# EAGLE board SE423_F28379D (EAGLE 7.7.0), part 1 of 2
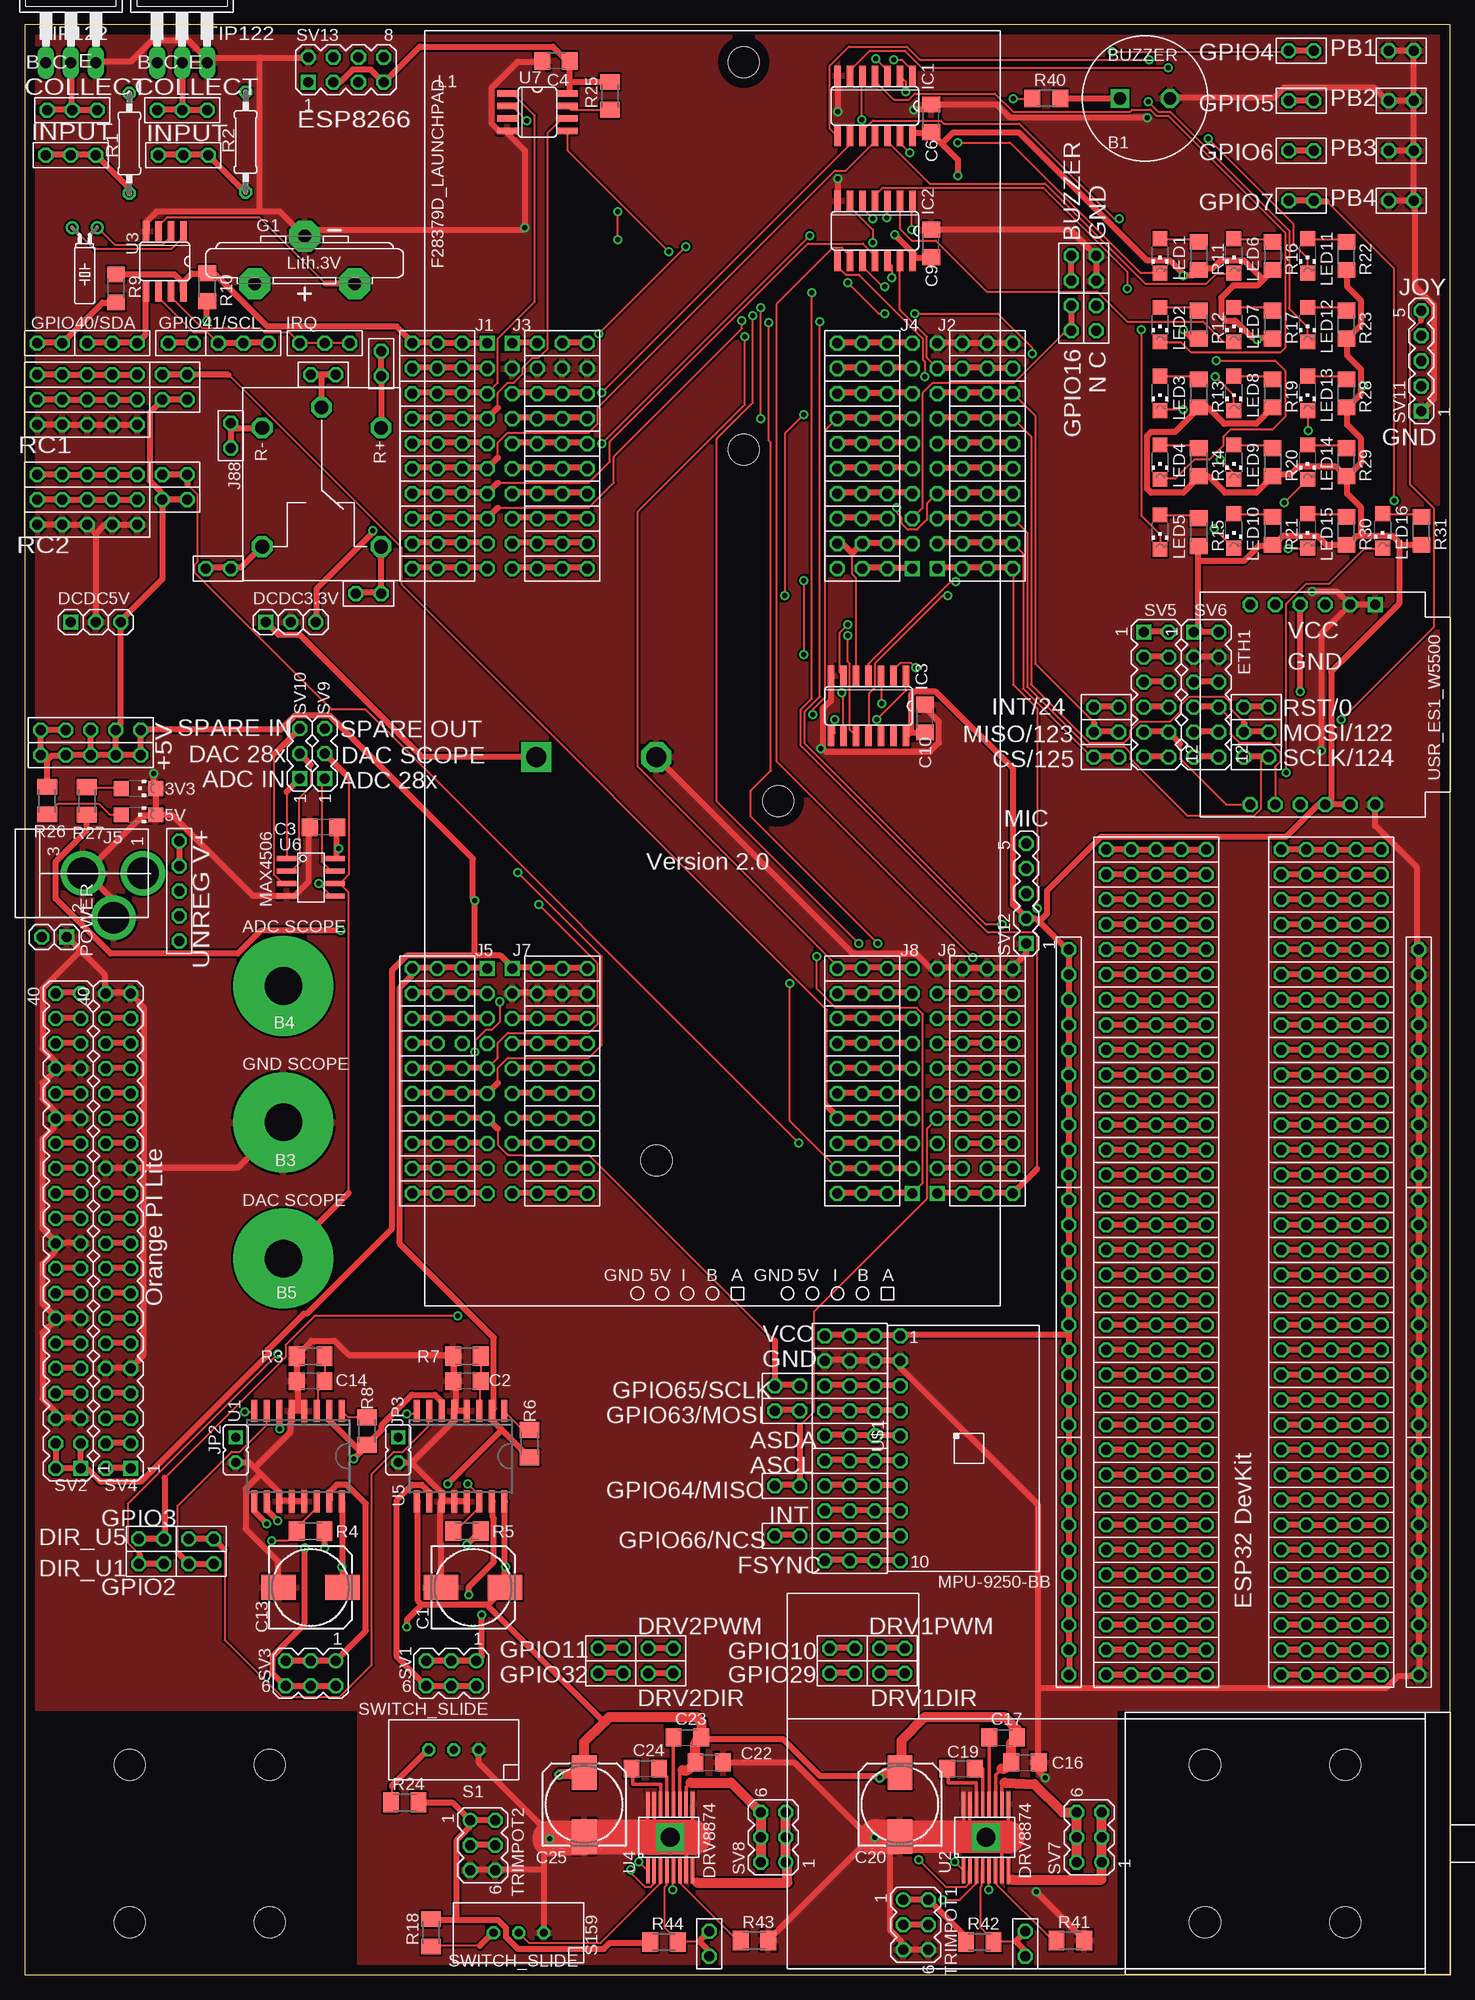
[diagram p5: board, top side]
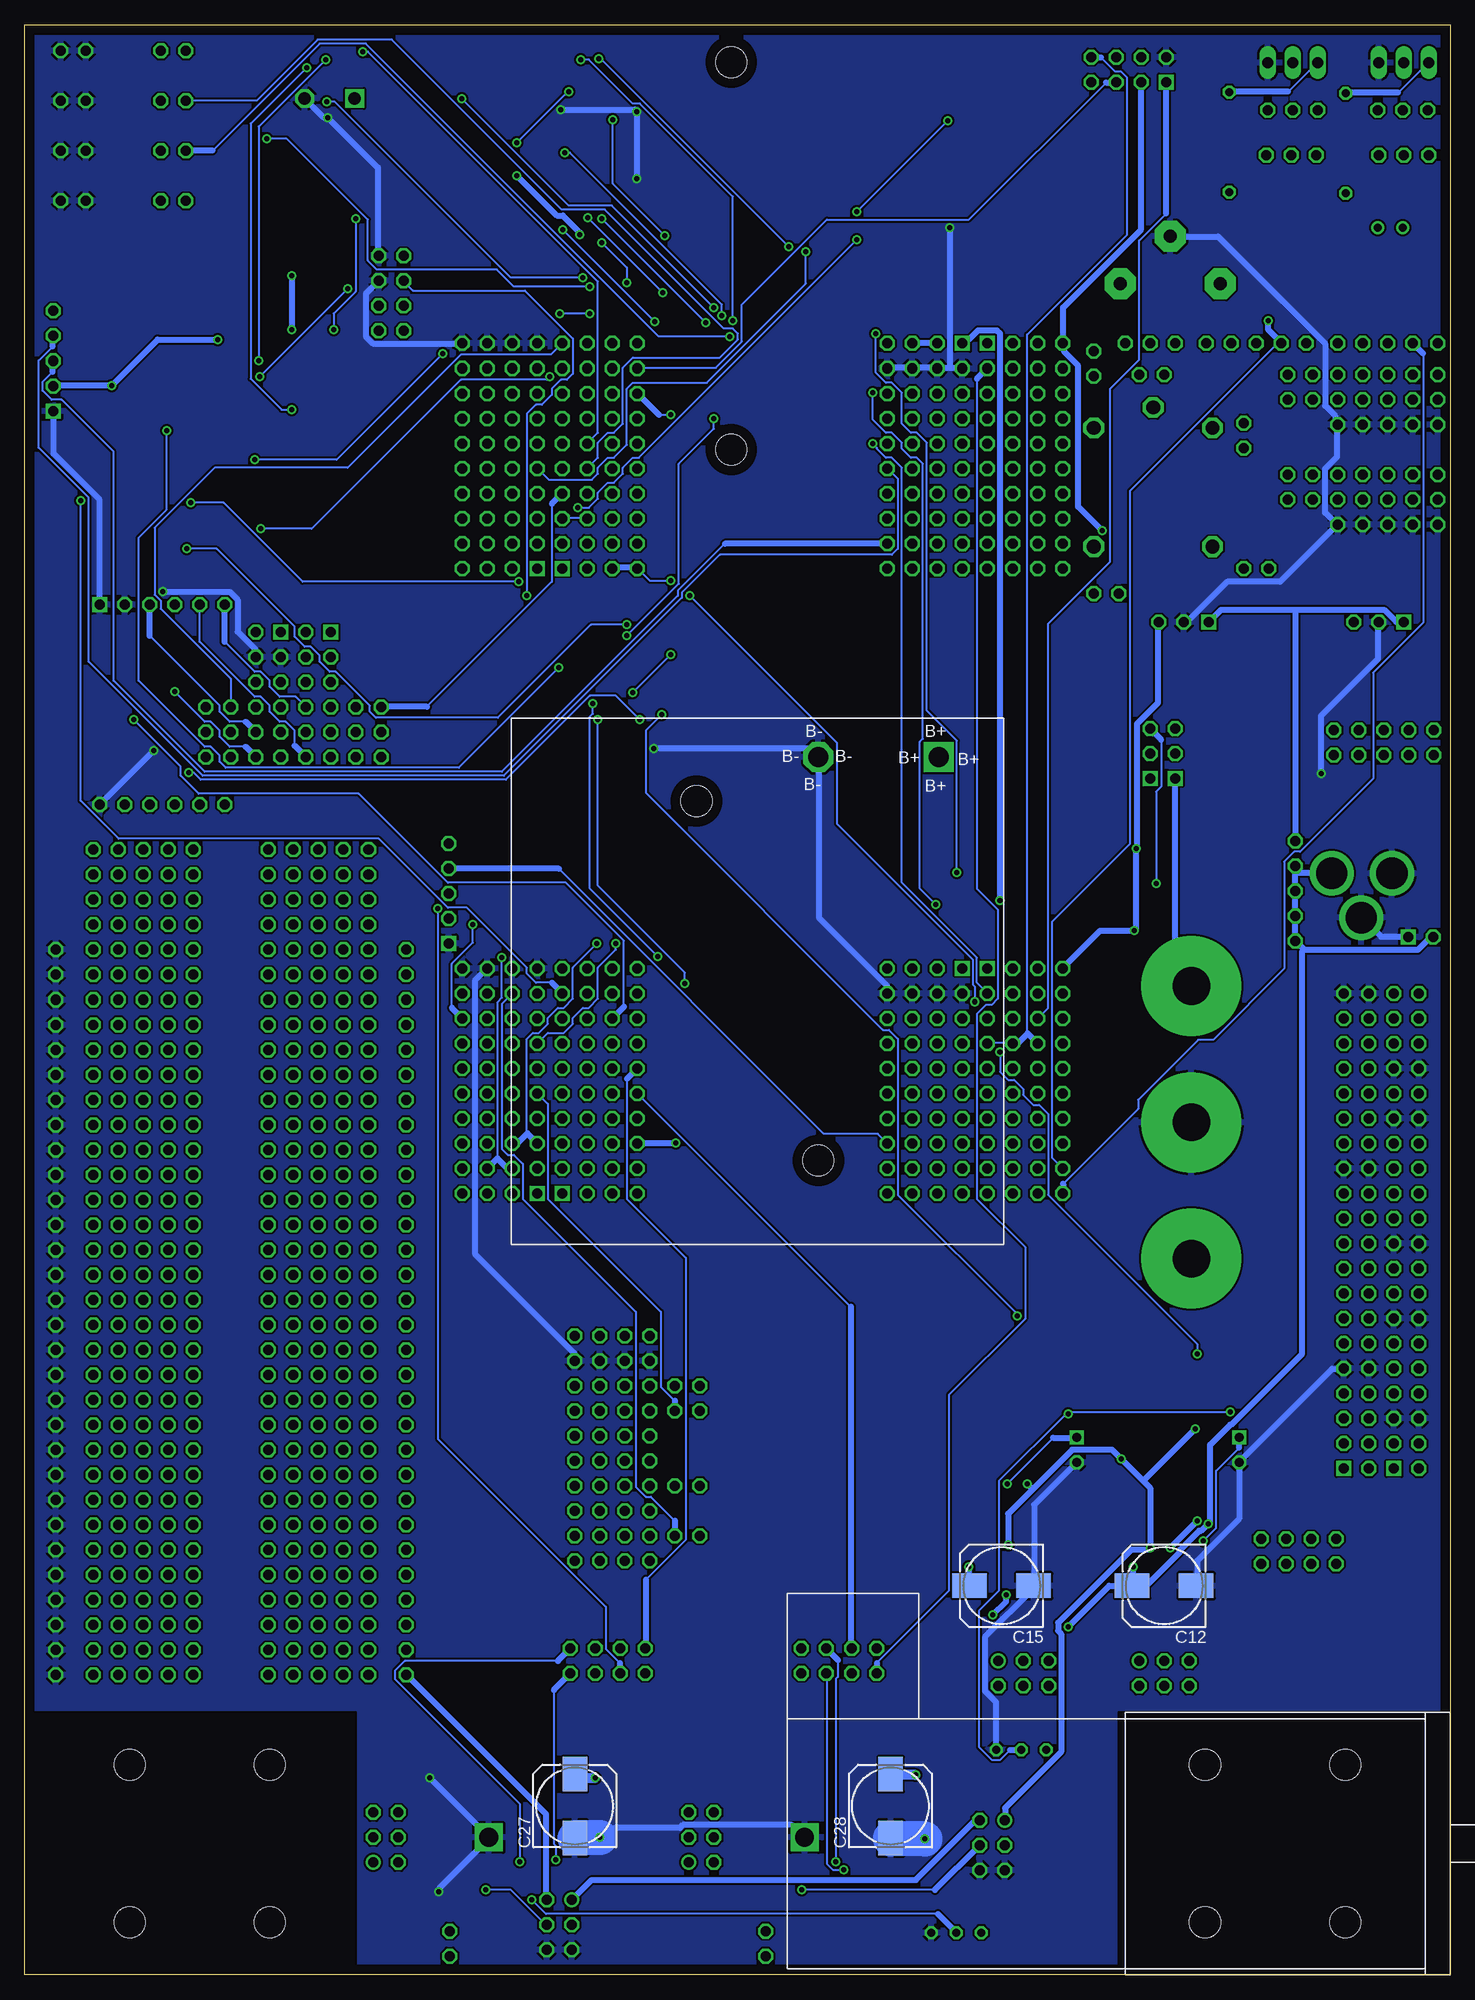
[diagram p6: board, bottom side, seen from below]

Size 144.78 x 198.12 mm. Coordinates in mm from the lower left corner, seen from the top.
Outline: 0,0 144.78,0 144.78,198.12 0,198.12 0,0
Copper layers (1*16): Top 0.035mm / dielectric 1.5mm / Bottom 0.035mm
Design rules "default *": minimum track width 7mil, minimum drill 20mil, track to track 8mil, track to pad 8mil, pad to pad 8mil, via to via 8mil, smd to smd 8mil, copper to edge 40mil, drill to drill 8mil, minimum pad ring 10mil, minimum via ring 8mil, stop-mask expansion 4mil, vias tented up to drill 20mil, thermal gap 10mil
Net classes: 0 default: width 0.203 mm, drill 0.508 mm, clearance 0.203 mm; 1 supply: width 0.61 mm, drill 0.508 mm, clearance 0.203 mm
tRestrict: area 0,0 to 33.7,26.7; area 111.1,0 to 144.8,26.7
bRestrict: area 111.1,0 to 144.8,26.7; area 0,0 to 33.7,26.7

## Footprints (pad centres in the part's own frame; a part is rotated, then mirrored left to right if it is on the bottom)
CHIPLED_1206 = smd 1.5 x 1.5: A 0,-1.75; C 0,1.75
BUZZER = drill 1.27 square: P$1 -2.54,0 | drill 1.27 octagon: P$2 2.54,0
BATTERY_4AA_HOLDER = drill 2.032 square: P$1 0,0 | drill 2.032 octagon: P$2 12.224,0 | hole 3.175: 12.224,40.958; 24.606,4.445
BANANA_MALE = drill 3.81 pad 10.16: P$1 0,0
153CLV-0810 = smd 3.5 x 2.5: + 3.25,0; - -3.25,0
C1206 = smd 1.6 x 1.8: 1 -1.4,0; 2 1.4,0
1X03 = drill 1.016 square: 1 -2.54,0 | drill 1.016 octagon: 2 0,0; 3 2.54,0
USR_ES1_W5500 = drill 1.016 square: P$1 0,0 | drill 1.016 octagon: P$2 0,-2.54; P$3 0,-5.08; P$4 0,-7.62; P$5 0,-10.16; P$6 0,-12.7; P$7 20.32,-12.7; P$8 20.32,-10.16; P$9 20.32,-7.62; P$10 20.32,-5.08; P$11 20.32,-2.54; P$12 20.32,0
CR2032V = drill 1.321 pad 3.15 octagon: + -2.54,-5.08; +@1 -2.54,5.08; - 2.286,0
SO14 = smd 0.66 x 2.032: 1 -3.81,-3.073; 2 -2.54,-3.073; 3 -1.27,-3.073; 4 0,-3.073; 5 1.27,-3.073; 6 2.54,-3.073; 7 3.81,-3.073; 8 3.81,3.073; 9 2.54,3.073; 10 1.27,3.073; 11 0,3.073; 12 -1.27,3.073; 13 -2.54,3.073; 14 -3.81,3.073
STRIP3 = drill 1.016 octagon: P$1 0,0; P$2 2.54,0; P$3 5.08,0
JACK-PMS = drill 3.175 pad 4.5: 1 -0.5,-3.31; 2 -5,-0.31; 3 -0.5,2.809
STRIP2 = drill 1.016 octagon: P$1 0,0; P$2 2.54,0
RELAY_JQC-3F_5V = drill 1.397 octagon: P$1 0,0; P$2 2.064,6.032; P$3 14.129,6.032; P$4 14.129,-6.032; P$5 2.064,-6.032
JP1 = drill 0.914 square: 1 0,-1.27 | drill 0.914 octagon: 2 0,1.27
F28379D_LAUNCHPAD = drill 1.016 square: P$1 -24.13,33.02; P$11 21.59,10.16; P$21 -21.59,33.02; P$31 19.05,10.16; P$41 -24.13,-30.48; P$51 21.59,-53.34; P$61 -21.59,-30.48; P$71 19.05,-53.34 | drill 1.016 octagon: P$2 -24.13,30.48; P$3 -24.13,27.94; P$4 -24.13,25.4; P$5 -24.13,22.86; P$6 -24.13,20.32; P$7 -24.13,17.78; P$8 -24.13,15.24; P$9 -24.13,12.7; P$10 -24.13,10.16; P$12 21.59,12.7; P$13 21.59,15.24; P$14 21.59,17.78; P$15 21.59,20.32; P$16 21.59,22.86; P$17 21.59,25.4; P$18 21.59,27.94; P$19 21.59,30.48; P$20 21.59,33.02; P$22 -21.59,30.48; P$23 -21.59,27.94; P$24 -21.59,25.4; P$25 -21.59,22.86; P$26 -21.59,20.32; P$27 -21.59,17.78; P$28 -21.59,15.24; P$29 -21.59,12.7; P$30 -21.59,10.16; P$32 19.05,12.7; P$33 19.05,15.24; P$34 19.05,17.78; P$35 19.05,20.32; P$36 19.05,22.86; P$37 19.05,25.4; P$38 19.05,27.94; P$39 19.05,30.48; P$40 19.05,33.02; P$42 -24.13,-33.02; P$43 -24.13,-35.56; P$44 -24.13,-38.1; P$45 -24.13,-40.64; P$46 -24.13,-43.18; P$47 -24.13,-45.72; P$48 -24.13,-48.26; P$49 -24.13,-50.8; P$50 -24.13,-53.34; P$52 21.59,-50.8; P$53 21.59,-48.26; P$54 21.59,-45.72; P$55 21.59,-43.18; P$56 21.59,-40.64; P$57 21.59,-38.1; P$58 21.59,-35.56; P$59 21.59,-33.02; P$60 21.59,-30.48; P$62 -21.59,-33.02; P$63 -21.59,-35.56; P$64 -21.59,-38.1; P$65 -21.59,-40.64; P$66 -21.59,-43.18; P$67 -21.59,-45.72; P$68 -21.59,-48.26; P$69 -21.59,-50.8; P$70 -21.59,-53.34; P$72 19.05,-50.8; P$73 19.05,-48.26; P$74 19.05,-45.72; P$75 19.05,-43.18; P$76 19.05,-40.64; P$77 19.05,-38.1; P$78 19.05,-35.56; P$79 19.05,-33.02; P$80 19.05,-30.48
1X02 = drill 1.016 square: 1 -1.27,0 | drill 1.016 octagon: 2 1.27,0
TC26H = drill 0.813: 1 -1.27,0; 2 1.27,0
0207/10 = drill 0.813 octagon: 1 -5.08,0; 2 5.08,0
M1206 = smd 1.6 x 2: 1 -1.4,0; 2 1.4,0
R1206 = smd 1.6 x 1.803: 1 -1.422,0; 2 1.422,0
SWITCH_SLIDE = drill 0.813 octagon: P$1 0,-5.08; P$2 0,-2.54; P$3 0,0
STRIP5 = drill 1.016 octagon: P$1 0,0; P$2 2.54,0; P$3 5.08,0; P$4 7.62,0; P$5 10.16,0
STRIP10 = drill 1.016 octagon: P$1 0,0; P$2 2.54,0; P$3 5.08,0; P$4 7.62,0; P$5 10.16,0; P$6 12.7,0; P$7 15.24,0; P$8 17.78,0; P$9 20.32,0; P$10 22.86,0
MA03-2 = drill 1.016: 1 -2.54,-1.27 | drill 1.016 octagon: 2 -2.54,1.27; 3 0,-1.27; 4 0,1.27; 5 2.54,-1.27; 6 2.54,1.27
MA20-2 = drill 1.016 square: 1 -24.13,-1.27 | drill 1.016 octagon: 2 -24.13,1.27; 3 -21.59,-1.27; 4 -21.59,1.27; 5 -19.05,-1.27; 6 -19.05,1.27; 7 -16.51,-1.27; 8 -16.51,1.27; 9 -13.97,-1.27; 10 -13.97,1.27; 11 -11.43,-1.27; 12 -11.43,1.27; 13 -8.89,-1.27; 14 -8.89,1.27; 15 -6.35,-1.27; 16 -6.35,1.27; 17 -3.81,-1.27; 18 -3.81,1.27; 19 -1.27,-1.27; 20 -1.27,1.27; 21 1.27,-1.27; 22 1.27,1.27; 23 3.81,-1.27; 24 3.81,1.27; 25 6.35,-1.27; 26 6.35,1.27; 27 8.89,-1.27; 28 8.89,1.27; 29 11.43,-1.27; 30 11.43,1.27; 31 13.97,-1.27; 32 13.97,1.27; 33 16.51,-1.27; 34 16.51,1.27; 35 19.05,-1.27; 36 19.05,1.27; 37 21.59,-1.27; 38 21.59,1.27; 39 24.13,-1.27; 40 24.13,1.27
MA06-2 = drill 1.016 square: 1 -6.35,-1.27 | drill 1.016 octagon: 2 -6.35,1.27; 3 -3.81,-1.27; 4 -3.81,1.27; 5 -1.27,-1.27; 6 -1.27,1.27; 7 1.27,-1.27; 8 1.27,1.27; 9 3.81,-1.27; 10 3.81,1.27; 11 6.35,-1.27; 12 6.35,1.27
MA03-1 = drill 1.016 square: 1 -2.54,0 | drill 1.016 octagon: 2 0,0; 3 2.54,0
MA05-1 = drill 1.016 square: 1 -5.08,0 | drill 1.016 octagon: 2 -2.54,0; 3 0,0; 4 2.54,0; 5 5.08,0
MA04-2 = drill 1.016 square: 1 -3.81,-1.27 | drill 1.016 octagon: 2 -3.81,1.27; 3 -1.27,-1.27; 4 -1.27,1.27; 5 1.27,-1.27; 6 1.27,1.27; 7 3.81,-1.27; 8 3.81,1.27
TO220 = drill 1.118 long: 1 -2.54,-6.35; 2 0,-6.35; 3 2.54,-6.35
SO16W = smd 0.6 x 2.2: 1 -4.445,-4.6; 2 -3.175,-4.6; 3 -1.905,-4.6; 4 -0.635,-4.6; 5 0.635,-4.6; 6 1.905,-4.6; 7 3.175,-4.6; 8 4.445,-4.6; 9 4.445,4.6; 10 3.175,4.6; 11 1.905,4.6; 12 0.635,4.6; 13 -0.635,4.6; 14 -1.905,4.6; 15 -3.175,4.6; 16 -4.445,4.6
HTSSOP16 = smd 2.5 x 0.35: P$1 -3.4,2.275; P$2 -3.4,1.625; P$3 -3.4,0.975; P$4 -3.4,0.325; P$5 -3.4,-0.325; P$6 -3.4,-0.975; P$7 -3.4,-1.625; P$8 -3.4,-2.275; P$9 3.4,-2.275; P$10 3.4,-1.625; P$11 3.4,-0.975; P$12 3.4,-0.325; P$13 3.4,0.325; P$14 3.4,0.975; P$15 3.4,1.625; P$16 3.4,2.275 | drill 1.905 pad 2.54 square: P$17 0,0
SO08 = smd 0.66 x 2.032: 1 -1.905,-3.073; 2 -0.635,-3.073; 3 0.635,-3.073; 4 1.905,-3.073; 5 1.905,3.073; 6 0.635,3.073; 7 -0.635,3.073; 8 -1.905,3.073
SOIC-8 = smd 1.98 x 0.53: P$1 -2.465,1.905; P$2 -2.465,0.635; P$3 -2.465,-0.635; P$4 -2.465,-1.905; P$5 2.465,-1.905; P$6 2.465,-0.635; P$7 2.465,0.635; P$8 2.465,1.905
MPU-9250-BB = drill 1.016 octagon: 1 -11.434,-6.96; 2 -8.894,-6.96; 3 -6.354,-6.96; 4 -3.814,-6.96; 5 -1.274,-6.96; 6 1.266,-6.96; 7 3.806,-6.96; 8 6.346,-6.96; 9 8.886,-6.96; 10 11.426,-6.96
GEARMOTOR_MOUNT = hole 3.175: 7.112,8.001; -7.112,8.001; -7.112,-8.001; 7.112,-8.001
CASTERWHEEL = hole 3.175: 19.685,0; -19.685,0

## Placement (x,y rotation side)
3V3  [CHIPLED_1206]  11.56,120.52 270 top
5V  [CHIPLED_1206]  11.56,117.86 270 top
B1  BUZZER  [BUZZER]  113.79,190.63 0 top
B2  BATTERY_4AA_HOLDER  [BATTERY_4AA_HOLDER]  51.94,123.7 180 bottom
B3  GND SCOPE  [BANANA_MALE]  26.29,86.61 0 top
B4  ADC SCOPE  [BANANA_MALE]  26.29,100.46 0 top
B5  DAC SCOPE  [BANANA_MALE]  26.29,72.77 0 top
C1  47uF  [153CLV-0810]  45.56,39.36 0 top
C2  680pF  [C1206]  44.92,60.32 180 top
C3  0.1uf  [C1206]  30.35,116.59 180 top
C4  0.1uf  [C1206]  53.98,194.44 180 top
C6  0.1uf  [C1206]  92.08,188.59 90 top
C9  0.1uf  [C1206]  92.08,175.9 90 top
C10  0.1uf  [C1206]  91.44,127.64 90 top
C12  47uF  [153CLV-0810]  29.05,39.53 180 bottom
C13  47uF  [153CLV-0810]  29.05,39.36 0 top
C14  680pF  [C1206]  29.05,60.32 180 top
C15  47uF  [153CLV-0810]  45.56,39.53 180 bottom
C16  0.1uF  [C1206]  101.6,21.59 0 top
C17  0.1uF  [C1206]  99.38,24.13 0 top
C19  22nF  [C1206]  95.09,20.95 0 top
C20  47uF  [153CLV-0810]  88.9,17.3 90 top
C22  0.1uF  [C1206]  69.53,21.59 0 top
C23  0.1uF  [C1206]  67.31,24.13 0 top
C24  22nF  [C1206]  63.02,20.95 0 top
C25  47uF  [153CLV-0810]  56.83,17.3 90 top
C27  47uF  [153CLV-0810]  88.9,17.14 90 bottom
C28  47uF  [153CLV-0810]  56.83,17.14 90 bottom
DCDC3.3V  [1X03]  27.05,137.41 0 top
DCDC5V  [1X03]  7.24,137.41 0 top
ETH1  USR_ES1_W5500  [USR_ES1_W5500]  137.16,139.19 270 top
G1  CR2032V  [CR2032V]  28.44,174.33 90 top
IC1  7404D  [SO14]  86.36,189.87 180 top
IC2  7404D  [SO14]  86.36,177.16 180 top
IC3  7404D  [SO14]  85.72,128.91 180 top
J1  STRIP3  [STRIP3]  27.94,165.74 0 top
J2  STRIP3  [STRIP3]  19.68,165.74 0 top
J3  STRIP3  [STRIP3]  6.35,165.74 0 top
J4  STRIP3  [STRIP3]  2.28,189.45 0 top
J5  [JACK-PMS]  8.72,112.4 90 top
J6  STRIP3  [STRIP3]  2.15,184.87 0 top
J7  STRIP2  [STRIP2]  108.84,172.09 90 top
J8  STRIP2  [STRIP2]  108.84,167 90 top
J9  STRIP2  [STRIP2]  108.58,128.78 0 top
J10  STRIP3  [STRIP3]  39.37,165.74 0 top
J11  STRIP2  [STRIP2]  123.83,128.78 0 top
J14  STRIP3  [STRIP3]  39.37,163.19 0 top
J15  STRIP3  [STRIP3]  39.37,160.66 0 top
J16  STRIP3  [STRIP3]  39.37,158.12 0 top
J17  STRIP3  [STRIP3]  39.37,155.57 0 top
J18  STRIP3  [STRIP3]  39.37,153.03 0 top
J19  STRIP3  [STRIP3]  39.37,150.5 0 top
J20  STRIP3  [STRIP3]  39.37,147.96 0 top
J21  STRIP3  [STRIP3]  39.37,145.41 0 top
J23  STRIP3  [STRIP3]  13.46,189.45 0 top
J24  STRIP3  [STRIP3]  13.58,184.87 0 top
J28  STRIP3  [STRIP3]  39.37,142.88 0 top
J29  STRIP3  [STRIP3]  95.25,142.88 0 top
J30  STRIP3  [STRIP3]  95.25,145.41 0 top
J31  STRIP3  [STRIP3]  95.25,147.96 0 top
J32  STRIP3  [STRIP3]  95.25,150.5 0 top
J33  STRIP3  [STRIP3]  95.25,153.03 0 top
J66  STRIP2  [STRIP2]  123.83,126.24 0 top
J67  STRIP2  [STRIP2]  108.58,126.24 0 top
J68  STRIP2  [STRIP2]  123.83,123.7 0 top
J69  STRIP2  [STRIP2]  108.58,123.7 0 top
J70  STRIP2  [STRIP2]  141.1,195.45 180 top
J71  STRIP2  [STRIP2]  130.94,195.45 180 top
J72  STRIP2  [STRIP2]  141.1,190.37 180 top
J73  STRIP2  [STRIP2]  130.94,190.37 180 top
J74  STRIP2  [STRIP2]  141.1,185.29 180 top
J75  STRIP2  [STRIP2]  130.94,185.29 180 top
J76  STRIP2  [STRIP2]  141.1,180.21 180 top
J77  STRIP2  [STRIP2]  130.94,180.21 180 top
J78  STRIP2  [STRIP2]  101.6,4.45 270 top
J79  STRIP2  [STRIP2]  86.84,33.18 0 top
J80  STRIP2  [STRIP2]  86.84,30.64 0 top
J81  STRIP2  [STRIP2]  69.53,4.45 270 top
J82  STRIP2  [STRIP2]  63.34,33.18 0 top
J83  STRIP2  [STRIP2]  63.34,30.64 0 top
J84  STRIP2  [STRIP2]  81.76,33.18 0 top
J85  STRIP2  [STRIP2]  81.76,30.64 0 top
J86  STRIP2  [STRIP2]  58.26,33.18 0 top
J87  STRIP2  [STRIP2]  58.26,30.64 0 top
J88  RELAY_JQC-3F_5V  [RELAY_JQC-3F_5V]  30.16,159.23 270 top
J89  STRIP2  [STRIP2]  36.2,164.94 270 top
J90  STRIP2  [STRIP2]  20.95,157.64 270 top
J91  STRIP2  [STRIP2]  29.05,162.56 0 top
J92  STRIP2  [STRIP2]  33.66,140.34 0 top
J93  STRIP2  [STRIP2]  18.41,142.88 0 top
J98  STRIP3  [STRIP3]  95.25,155.57 0 top
J99  STRIP3  [STRIP3]  95.25,158.12 0 top
J100  STRIP3  [STRIP3]  95.25,160.66 0 top
J101  STRIP3  [STRIP3]  95.25,163.19 0 top
J102  STRIP3  [STRIP3]  95.25,165.74 0 top
J103  STRIP3  [STRIP3]  52.07,165.74 0 top
J104  STRIP3  [STRIP3]  52.07,163.19 0 top
J105  STRIP3  [STRIP3]  52.07,160.66 0 top
J106  STRIP3  [STRIP3]  52.07,158.12 0 top
J107  STRIP3  [STRIP3]  52.07,155.57 0 top
J108  STRIP3  [STRIP3]  52.07,153.03 0 top
J109  STRIP3  [STRIP3]  52.07,150.5 0 top
J110  STRIP3  [STRIP3]  52.07,147.96 0 top
J111  STRIP3  [STRIP3]  52.07,145.41 0 top
J112  STRIP3  [STRIP3]  52.07,142.88 0 top
J113  STRIP3  [STRIP3]  82.55,142.88 0 top
J114  STRIP3  [STRIP3]  82.55,145.41 0 top
J115  STRIP3  [STRIP3]  82.55,147.96 0 top
J116  STRIP3  [STRIP3]  82.55,150.5 0 top
J117  STRIP3  [STRIP3]  82.55,153.03 0 top
J118  STRIP3  [STRIP3]  82.55,155.57 0 top
J119  STRIP3  [STRIP3]  82.55,158.12 0 top
J120  STRIP3  [STRIP3]  82.55,160.66 0 top
J121  STRIP3  [STRIP3]  82.55,163.19 0 top
J122  STRIP3  [STRIP3]  82.55,165.74 0 top
J123  STRIP3  [STRIP3]  81.28,64.93 0 top
J124  STRIP3  [STRIP3]  81.28,62.39 0 top
J125  STRIP3  [STRIP3]  81.28,59.85 0 top
J126  STRIP3  [STRIP3]  81.28,57.31 0 top
J127  STRIP3  [STRIP3]  81.28,54.77 0 top
J128  STRIP3  [STRIP3]  81.28,52.23 0 top
J129  STRIP3  [STRIP3]  81.28,49.69 0 top
J130  STRIP3  [STRIP3]  81.28,47.15 0 top
J131  STRIP3  [STRIP3]  81.28,44.61 0 top
J132  STRIP3  [STRIP3]  81.28,42.07 0 top
J133  STRIP3  [STRIP3]  82.55,102.23 0 top
J134  STRIP3  [STRIP3]  82.55,99.69 0 top
J135  STRIP3  [STRIP3]  82.55,97.16 0 top
J136  STRIP3  [STRIP3]  82.55,94.61 0 top
J137  STRIP3  [STRIP3]  82.55,92.08 0 top
J138  STRIP3  [STRIP3]  82.55,89.53 0 top
J139  STRIP3  [STRIP3]  82.55,87 0 top
J140  STRIP3  [STRIP3]  82.55,84.45 0 top
J141  STRIP3  [STRIP3]  82.55,81.92 0 top
J142  STRIP3  [STRIP3]  82.55,79.38 0 top
J143  STRIP3  [STRIP3]  52.07,79.38 0 top
J144  STRIP3  [STRIP3]  52.07,81.92 0 top
J145  STRIP3  [STRIP3]  52.07,84.45 0 top
J146  STRIP3  [STRIP3]  52.07,87 0 top
J147  STRIP3  [STRIP3]  52.07,89.53 0 top
J148  STRIP3  [STRIP3]  52.07,92.08 0 top
J149  STRIP3  [STRIP3]  52.07,94.61 0 top
J150  STRIP3  [STRIP3]  52.07,97.16 0 top
J151  STRIP3  [STRIP3]  52.07,99.69 0 top
J152  STRIP3  [STRIP3]  52.07,102.23 0 top
J153  STRIP3  [STRIP3]  95.25,102.23 0 top
J154  STRIP3  [STRIP3]  95.25,99.69 0 top
J155  STRIP3  [STRIP3]  95.25,97.16 0 top
J156  STRIP3  [STRIP3]  95.25,94.61 0 top
J157  STRIP3  [STRIP3]  95.25,92.08 0 top
J158  STRIP3  [STRIP3]  95.25,89.53 0 top
J159  STRIP3  [STRIP3]  95.25,87 0 top
J160  STRIP3  [STRIP3]  95.25,84.45 0 top
J161  STRIP3  [STRIP3]  95.25,81.92 0 top
J162  STRIP3  [STRIP3]  95.25,79.38 0 top
J163  STRIP3  [STRIP3]  39.37,79.38 0 top
J164  STRIP3  [STRIP3]  39.37,81.92 0 top
J165  STRIP3  [STRIP3]  39.37,84.45 0 top
J166  STRIP3  [STRIP3]  39.37,87 0 top
J167  STRIP3  [STRIP3]  39.37,89.53 0 top
J168  STRIP3  [STRIP3]  39.37,92.08 0 top
J169  STRIP3  [STRIP3]  39.37,94.61 0 top
J170  STRIP3  [STRIP3]  39.37,97.16 0 top
J176  STRIP3  [STRIP3]  39.37,99.69 0 top
J177  STRIP3  [STRIP3]  39.37,102.23 0 top
J194  STRIP2  [STRIP2]  106.3,172.09 90 top
J196  STRIP2  [STRIP2]  16.67,41.75 0 top
J197  STRIP2  [STRIP2]  16.67,44.29 0 top
J198  STRIP2  [STRIP2]  11.59,41.75 0 top
J199  STRIP2  [STRIP2]  11.59,44.29 0 top
J200  STRIP2  [STRIP2]  13.97,160.02 0 top
J201  STRIP2  [STRIP2]  13.97,162.56 0 top
J202  STRIP2  [STRIP2]  13.97,152.4 0 top
J203  STRIP2  [STRIP2]  13.97,149.86 0 top
J204  STRIP2  [STRIP2]  76.2,57.31 0 top
J205  STRIP2  [STRIP2]  76.2,49.69 0 top
J206  STRIP2  [STRIP2]  76.2,59.85 0 top
J207  STRIP2  [STRIP2]  76.2,44.61 0 top
J208  STRIP2  [STRIP2]  1.27,165.74 0 top
J209  STRIP2  [STRIP2]  14.61,165.74 0 top
J251  STRIP2  [STRIP2]  106.3,167 90 top
JP2  [JP1]  21.43,53.33 180 top
JP3  [JP1]  37.94,53.33 180 top
L1  F28379D_LAUNCHPAD  [F28379D_LAUNCHPAD]  71.12,132.72 0 top
LED1  [CHIPLED_1206]  115.32,174.62 180 top
LED2  [CHIPLED_1206]  115.32,167.64 180 top
LED3  [CHIPLED_1206]  115.32,160.66 180 top
LED4  [CHIPLED_1206]  115.32,153.67 180 top
LED5  [CHIPLED_1206]  115.32,146.56 180 top
LED6  [CHIPLED_1206]  122.81,174.62 180 top
LED7  [CHIPLED_1206]  122.81,167.64 180 top
LED8  [CHIPLED_1206]  122.81,160.66 180 top
LED9  [CHIPLED_1206]  122.81,153.67 180 top
LED10  [CHIPLED_1206]  122.81,146.69 180 top
LED11  [CHIPLED_1206]  130.3,174.62 180 top
LED12  [CHIPLED_1206]  130.3,167.64 180 top
LED13  [CHIPLED_1206]  130.3,160.66 180 top
LED14  [CHIPLED_1206]  130.3,153.67 180 top
LED15  [CHIPLED_1206]  130.3,146.69 180 top
LED16  [CHIPLED_1206]  137.92,146.69 180 top
POWER  [1X02]  3.01,105.42 180 top
Q1  32.768KHz  [TC26H]  6.09,177.51 180 top
R1  R_B  [0207/10]  10.63,186.06 90 top
R2  R_B  [0207/10]  22.44,186.19 90 top
R3  24.9K  [M1206]  29.05,62.86 0 top
R4  2.2K  [M1206]  29.05,45.08 0 top
R5  2.2K  [M1206]  44.92,45.08 0 top
R6  2.2K  [M1206]  51.27,53.97 270 top
R7  24.9K  [M1206]  44.92,62.86 0 top
R8  2.2K  [M1206]  34.76,55.24 270 top
R9  10K  [R1206]  9.27,171.32 270 top
R10  10K  [R1206]  18.54,171.45 270 top
R11  [R1206]  119.25,174.62 270 top
R12  [R1206]  119.25,167.64 270 top
R13  [R1206]  119.25,160.66 270 top
R14  [R1206]  119.25,153.67 270 top
R15  [R1206]  119.25,146.56 270 top
R16  [R1206]  126.75,174.62 270 top
R17  [R1206]  126.75,167.64 270 top
R18  2.2K  [M1206]  41.27,4.28 90 top
R19  [R1206]  126.75,160.66 270 top
R20  [R1206]  126.75,153.67 270 top
R21  [R1206]  126.75,146.69 270 top
R22  [R1206]  134.24,174.62 270 top
R23  [R1206]  134.24,167.64 270 top
R24  2.2K  [M1206]  38.61,17.53 0 top
R25  10K  [M1206]  59.44,190.88 90 top
R26  470  [M1206]  2.29,119.29 90 top
R27  470  [M1206]  6.31,119.26 270 top
R28  [R1206]  134.24,160.66 270 top
R29  [R1206]  134.24,153.67 270 top
R30  [R1206]  134.24,146.69 270 top
R31  [R1206]  141.86,146.69 270 top
R40  100  [R1206]  103.76,190.63 0 top
R41  1.8K  [M1206]  106.2,3.49 0 top
R42  10K  [M1206]  97,3.33 0 top
R43  1.8K  [M1206]  74.14,3.49 0 top
R44  10K  [M1206]  64.93,3.33 0 top
S1  SWITCH_SLIDE  [SWITCH_SLIDE]  41.02,22.86 90 top
S17  STRIP5  [STRIP5]  11.81,123.91 180 top
S18  STRIP5  [STRIP5]  11.81,126.45 180 top
S20  STRIP10  [STRIP10]  141.6,30.48 90 top
S24  STRIP10  [STRIP10]  141.6,55.88 90 top
S28  STRIP10  [STRIP10]  141.6,81.28 90 top
S50  STRIP10  [STRIP10]  106.05,81.28 90 top
S53  STRIP10  [STRIP10]  106.05,30.48 90 top
S58  STRIP10  [STRIP10]  106.05,55.88 90 top
S97  STRIP5  [STRIP5]  109.86,114.3 0 top
S98  STRIP5  [STRIP5]  109.86,111.76 0 top
S99  STRIP5  [STRIP5]  109.86,109.22 0 top
S101  STRIP5  [STRIP5]  109.86,106.68 0 top
S105  STRIP5  [STRIP5]  109.86,104.14 0 top
S108  STRIP5  [STRIP5]  109.86,101.6 0 top
S129  STRIP5  [STRIP5]  11.43,157.48 180 top
S130  STRIP5  [STRIP5]  11.43,162.56 180 top
S137  STRIP5  [STRIP5]  11.43,147.32 180 top
S138  STRIP5  [STRIP5]  11.43,152.4 180 top
S139  STRIP5  [STRIP5]  11.43,149.86 180 top
S140  STRIP5  [STRIP5]  109.86,99.06 0 top
S141  STRIP5  [STRIP5]  15.71,105.03 90 top
S147  STRIP5  [STRIP5]  11.43,160.02 180 top
S159  SWITCH_SLIDE  [SWITCH_SLIDE]  47.62,4.28 90 top
S160  STRIP5  [STRIP5]  109.86,96.52 0 top
S161  STRIP5  [STRIP5]  109.86,93.98 0 top
S162  STRIP5  [STRIP5]  109.86,91.44 0 top
S163  STRIP5  [STRIP5]  109.86,88.9 0 top
S164  STRIP5  [STRIP5]  109.86,86.36 0 top
S165  STRIP5  [STRIP5]  109.86,83.82 0 top
S166  STRIP5  [STRIP5]  109.86,81.28 0 top
S167  STRIP5  [STRIP5]  109.86,78.74 0 top
S168  STRIP5  [STRIP5]  109.86,76.2 0 top
S169  STRIP5  [STRIP5]  109.86,73.66 0 top
S170  STRIP5  [STRIP5]  109.86,71.12 0 top
S171  STRIP5  [STRIP5]  109.86,68.58 0 top
S172  STRIP5  [STRIP5]  109.86,66.04 0 top
S173  STRIP5  [STRIP5]  109.86,63.5 0 top
S174  STRIP5  [STRIP5]  109.86,60.96 0 top
S175  STRIP5  [STRIP5]  109.86,58.42 0 top
S176  STRIP5  [STRIP5]  109.86,55.88 0 top
S177  STRIP5  [STRIP5]  109.86,53.34 0 top
S178  STRIP5  [STRIP5]  109.86,50.8 0 top
S179  STRIP5  [STRIP5]  109.86,48.26 0 top
S180  STRIP5  [STRIP5]  109.86,45.72 0 top
S181  STRIP5  [STRIP5]  109.86,43.18 0 top
S182  STRIP5  [STRIP5]  109.86,40.64 0 top
S183  STRIP5  [STRIP5]  109.86,38.1 0 top
S184  STRIP5  [STRIP5]  109.86,35.56 0 top
S185  STRIP5  [STRIP5]  109.86,33.02 0 top
S186  STRIP5  [STRIP5]  109.86,30.48 0 top
S187  STRIP5  [STRIP5]  127.64,30.48 0 top
S188  STRIP5  [STRIP5]  127.64,35.56 0 top
S189  STRIP5  [STRIP5]  127.64,33.02 0 top
S196  STRIP5  [STRIP5]  127.64,114.3 0 top
S197  STRIP5  [STRIP5]  127.64,111.76 0 top
S198  STRIP5  [STRIP5]  127.64,109.22 0 top
S199  STRIP5  [STRIP5]  127.64,106.68 0 top
S200  STRIP5  [STRIP5]  127.64,104.14 0 top
S201  STRIP5  [STRIP5]  127.64,101.6 0 top
S202  STRIP5  [STRIP5]  127.64,99.06 0 top
S203  STRIP5  [STRIP5]  127.64,96.52 0 top
S204  STRIP5  [STRIP5]  127.64,93.98 0 top
S205  STRIP5  [STRIP5]  127.64,91.44 0 top
S206  STRIP5  [STRIP5]  127.64,88.9 0 top
S207  STRIP5  [STRIP5]  127.64,86.36 0 top
S208  STRIP5  [STRIP5]  127.64,83.82 0 top
S209  STRIP5  [STRIP5]  127.64,81.28 0 top
S210  STRIP5  [STRIP5]  127.64,78.74 0 top
S211  STRIP5  [STRIP5]  127.64,76.2 0 top
S212  STRIP5  [STRIP5]  127.64,73.66 0 top
S213  STRIP5  [STRIP5]  127.64,71.12 0 top
S214  STRIP5  [STRIP5]  127.64,68.58 0 top
S215  STRIP5  [STRIP5]  127.64,66.04 0 top
S216  STRIP5  [STRIP5]  127.64,63.5 0 top
S217  STRIP5  [STRIP5]  127.64,60.96 0 top
S218  STRIP5  [STRIP5]  127.64,58.42 0 top
S219  STRIP5  [STRIP5]  127.64,55.88 0 top
S220  STRIP5  [STRIP5]  127.64,53.34 0 top
S221  STRIP5  [STRIP5]  127.64,50.8 0 top
S222  STRIP5  [STRIP5]  127.64,48.26 0 top
S223  STRIP5  [STRIP5]  127.64,45.72 0 top
S224  STRIP5  [STRIP5]  127.64,43.18 0 top
S225  STRIP5  [STRIP5]  127.64,40.64 0 top
S226  STRIP5  [STRIP5]  127.64,38.1 0 top
SV1  [MA03-2]  43.33,30.63 180 top
SV2  [MA20-2]  4.45,75.56 90 top
SV3  [MA03-2]  29.05,30.63 180 top
SV4  [MA20-2]  9.53,75.56 90 top
SV5  [MA06-2]  114.94,130.05 270 top
SV6  [MA06-2]  120.02,130.05 270 top
SV7  [MA03-2]  108.11,13.97 90 top
SV8  [MA03-2]  76.04,13.97 90 top
SV9  [MA03-1]  30.48,124.08 90 top
SV10  [MA03-1]  27.94,124.08 90 top
SV11  [MA05-1]  141.86,163.96 90 top
SV12  [MA05-1]  101.73,109.86 90 top
SV13  [MA04-2]  32.64,193.55 0 top
T1  TIP125  [TO220]  4.69,200.62 0 top
T2  TIP125  [TO220]  16,200.62 0 top
TRIMPOT1  [MA03-2]  90.49,5.08 270 top
TRIMPOT2  [MA03-2]  46.51,13.18 270 top
U1  A4973  [SO16W]  27.78,52.7 180 top
U2  DRV8874  [HTSSOP16]  97.63,13.97 90 top
U3  BQ32000  [SO08]  14.22,174.08 180 top
U4  DRV8874  [HTSSOP16]  65.56,13.97 90 top
U5  A4973  [SO16W]  44.29,52.7 180 top
U6  MAX4506  [SOIC-8]  29.08,111.51 0 top
U7  IS62WVS512  [SO08]  52.07,189.23 270 top
U$1  MPU-9250-BB  [MPU-9250-BB]  95.89,53.5 270 top
U$2  GEARMOTOR_MOUNT  [GEARMOTOR_MOUNT]  127,13.34 0 top
U$3  GEARMOTOR_MOUNT  [GEARMOTOR_MOUNT]  17.78,13.34 0 bottom
U$4  CASTERWHEEL  [CASTERWHEEL]  73.03,174.62 90 top

## Tracks (layer width: path | path; a pad name or v marks a point on that pad's centre or on a via)
+5V  (via drill 0.51)
  Top 0.61: J203.P$2 J203.P$1 | J200.P$2 J200.P$1 13.82,159.82 12.7,158.7 12.7,151.79 13.82,150.67 13.82,150.06 J203.P$1 | 2.23,123.34 2.23,120.7 R26.2 | 2.23,123.34 1.73,123.85 S17.P$5 1.63,124.16 1.63,126.39 S18.P$5 1.93,126.49 4.17,126.49 S18.P$4 | 2.23,123.34 2.74,123.85 4.17,123.85 S17.P$4 4.47,123.95 6.71,123.95 S17.P$3 | S18.P$3 6.71,126.39 6.71,124.26 S17.P$3 | S17.P$2 9.25,123.95 7.01,123.95 S17.P$3 | S17.P$2 9.25,124.26 9.25,126.39 S18.P$2 9.45,126.69 9.75,127 9.75,137.36 DCDC5V.3 9.86,137.67 14.02,141.83 14.02,149.56 J203.P$1 | S17.P$2 9.55,123.95 11.79,123.95 S17.P$1 11.79,124.26 11.79,126.39 S18.P$1 12.09,126.49 26.01,126.49 27.43,127.91 30.99,127.91 45.52,113.39 45.52,109.32 v45.72,109.12 45.72,103.53 | L1.P$21 49.58,165.81 52.02,165.81 J103.P$1 | J103.P$2 54.66,165.81 57.1,165.81 J103.P$3 | SV2.4 3.15,53.95 3.15,51.51 SV2.2 3.45,51.51 5.69,51.51 SV2.1 | SV2.3 5.69,53.95 5.69,51.82 SV2.1 | J152.P$3 57.1,102.31 54.86,102.31 J152.P$2 54.56,102.31 52.32,102.31 J152.P$1 52.02,102.31 49.58,102.31 L1.P$61 49.38,102.51 48.36,103.53 45.72,103.53 | 45.72,103.53 38.81,103.53 37.29,102.01 37.29,75.79 28.65,67.16 28.35,67.16 24.69,63.5 24.69,62.99 11.79,50.09 7.72,50.09 6.5,51.31 5.99,51.31 SV2.1
  Bottom 0.61: J103.P$1 52.12,165.81 54.56,165.81 J103.P$2 | v45.72,109.12 45.72,166.73 46.02,167.03 47.95,167.03 49.17,165.81 49.48,165.81 L1.P$21
A4973EN  (via drill 0.51)
  Top 0.203: v22.35,57.2 23.27,57.2 U1.8 | v38.81,57 39.62,57 39.83,57.2 U5.8
  Bottom 0.203: v22.35,57.2 38.61,57.2 v38.81,57 39.01,57 45.82,50.19 45.82,39.01 47.85,36.98 47.85,23.16 46.53,21.84 45.72,21.84 44.7,22.86
  Bottom 0.61: 44.7,22.86 S1.P$2
ADCIN14
  Top 0.203: 52.12,160.73 J105.P$1 | 54.56,160.73 J105.P$2
  Top 0.61: L1.P$23 49.58,160.73 52.02,160.73 J105.P$1 | J105.P$2 54.66,160.73 57.1,160.73 J105.P$3 | 54.56,160.73 52.12,160.73
ADCIN15
  Top 0.203: 52.02,97.23 J150.P$1 | 54.56,97.23 J150.P$2
  Top 0.61: 52.02,97.23 49.58,97.23 L1.P$63 | J150.P$2 54.66,97.23 57.1,97.23 J150.P$3 | 54.56,97.23 52.12,97.23 J150.P$1
ADCINA2
  Top 0.203: 54.66,145.49 J111.P$2 | 52.12,145.49 J111.P$1
  Top 0.61: L1.P$29 49.58,145.49 52.02,145.49 J111.P$1 | 54.66,145.49 57.1,145.49 J111.P$3 | 52.12,145.49 54.56,145.49 J111.P$2
  Bottom 0.203: 141.94,162.87 142.95,161.85 142.95,160.93 142.04,160.02 141.02,160.02 135.74,154.74 135.74,131.47 126.49,122.22 96.32,122.22 78.44,140.11 78.44,140.61 73.66,145.39 | 141.94,163.88 SV11.3
  Bottom 0.61: 141.94,162.87 141.94,163.88 | 73.66,145.39 57.2,145.39 J111.P$3
ADCINA3
  Top 0.203: 52.02,153.11 J108.P$1 | 54.66,153.11 J108.P$2
  Top 0.61: 52.02,153.11 49.58,153.11 L1.P$26 | 54.66,153.11 57.1,153.11 J108.P$3 | J108.P$1 52.12,153.11 54.56,153.11 J108.P$2
  Bottom 0.203: 141.94,165.41 143.36,163.98 143.36,155.14 138.28,150.06 138.28,133.4 126.69,121.82 96.11,121.82 78.03,139.9 78.03,140.41 74.17,144.27 56.69,144.27 56.08,144.88 56.08,151.99 57.1,153.01 J108.P$3 | 141.94,166.42 SV11.4
  Bottom 0.61: 141.94,165.41 141.94,166.42
ADCINA4
  Top 0.203: 52.12,81.99 J144.P$1 | 54.56,81.99 J144.P$2
  Top 0.61: L1.P$69 49.58,81.99 52.02,81.99 J144.P$1 | J144.P$2 54.66,81.99 57.1,81.99 J144.P$3 | 54.56,81.99 52.12,81.99
ADCINA5
  Top 0.203: 52.02,89.61 J147.P$1 | 54.66,89.61 J147.P$2
  Top 0.61: 52.02,89.61 49.58,89.61 L1.P$66 | 54.66,89.61 57.1,89.61 J147.P$3 | J147.P$1 52.12,89.61 54.56,89.61 J147.P$2
ADCINB2
  Top 0.203: 52.12,148.03 J110.P$1 | 54.56,148.03 J110.P$2
  Top 0.61: L1.P$28 49.58,148.03 52.02,148.03 J110.P$1 | J110.P$2 54.66,148.03 57.1,148.03 J110.P$3 | 54.56,148.03 52.12,148.03
ADCINB3
  Top 0.203: 52.02,155.65 J107.P$1 | 54.66,155.65 J107.P$2
  Top 0.61: 52.02,155.65 49.58,155.65 L1.P$25 | 54.66,155.65 57.1,155.65 J107.P$3 | J107.P$1 52.12,155.65 54.56,155.65 J107.P$2
ADCINB4
  Top 0.203: 52.12,84.53 J145.P$1 | 54.56,84.53 J145.P$2
  Top 0.61: L1.P$68 49.58,84.53 52.02,84.53 J145.P$1 | J145.P$2 54.66,84.53 57.1,84.53 J145.P$3 | 54.56,84.53 52.12,84.53
  Bottom 0.203: 90.53,112.37 63.6,85.45 58.12,85.45 57.2,84.53 J145.P$3 | 101.7,112.37 SV12.4
  Bottom 0.61: 90.53,112.37 101.7,112.37
ADCINB5
  Top 0.203: 52.02,92.15 J148.P$1 | 54.66,92.15 J148.P$2
  Top 0.61: 52.02,92.15 49.58,92.15 L1.P$65 | 54.66,92.15 57.1,92.15 J148.P$3 | J148.P$1 52.12,92.15 54.56,92.15 J148.P$2
ADCINC2
  Top 0.203: 52.02,150.57 J109.P$1 | 54.66,150.57 J109.P$2
  Top 0.61: 52.02,150.57 49.58,150.57 L1.P$27 | 54.66,150.57 57.1,150.57 J109.P$3 | J109.P$1 52.12,150.57 54.56,150.57 J109.P$2
ADCINC3
  Top 0.203: 52.02,158.19 J106.P$1 | 54.66,158.19 J106.P$2
  Top 0.61: 52.02,158.19 49.58,158.19 L1.P$24 | 54.66,158.19 57.1,158.19 J106.P$3 | J106.P$1 52.12,158.19 54.56,158.19 J106.P$2
ADCINC4
  Top 0.203: 52.02,87.07 J146.P$1 | 54.56,87.07 J146.P$2
  Top 0.61: 52.02,87.07 49.58,87.07 L1.P$67 | J146.P$2 54.66,87.07 57.1,87.07 J146.P$3 | 54.56,87.07 52.12,87.07 J146.P$1
ADCINC5
  Top 0.203: 52.02,94.69 J149.P$1 | 54.56,94.69 J149.P$2
  Top 0.61: 52.02,94.69 49.58,94.69 L1.P$64 | J149.P$2 54.66,94.69 57.1,94.69 J149.P$3 | 54.56,94.69 52.12,94.69 J149.P$1
DACOUTA
  Top 0.203: 52.02,142.95 J112.P$1 | 54.56,142.95 J112.P$2
  Top 0.61: 52.02,142.95 49.58,142.95 L1.P$30 | J112.P$2 54.66,142.95 57.1,142.95 J112.P$3 | 54.56,142.95 52.12,142.95 J112.P$1
DACOUTB
  Top 0.203: 54.66,79.45 J143.P$2 | 52.12,79.45 J143.P$1
  Top 0.61: L1.P$70 49.58,79.45 52.02,79.45 J143.P$1 | 54.66,79.45 57.1,79.45 J143.P$3 | 52.12,79.45 54.56,79.45 J143.P$2
DRV1_DIR  (via drill 0.51)
  Top 0.203: v90.83,11.68 93.57,8.94 95.61,8.94 95.91,9.25 95.91,10.57 U2.P$2 | 86.87,30.68 J80.P$1 | 89.31,30.68 J80.P$2
  Top 0.61: 89.31,30.68 86.87,30.68
  Bottom 0.203: v90.83,11.68 90.83,13.11 91.03,13.31 91.03,28.96 | 89.41,30.58 J80.P$2
  Bottom 0.61: 89.41,30.58 91.03,28.96
DRV1_M+
  Top 0.356: U2.P$8 99.91,9.31 100.33,9.53
  Top 0.762: 100.33,9.53 100.33,9.68
  Top 1.016: 100.33,9.68 109.38,9.68 SV7.1 SV7.3 SV7.5
DRV1_M-
  Top 0.356: U2.P$10 99.26,19.25 99.54,19.53
  Top 1.016: 99.54,19.53 102.55,19.37 105.41,16.51 SV7.6 SV7.4 SV7.2
DRV1_PWM  (via drill 0.51)
  Top 0.203: v94.49,11.48 95.3,10.67 U2.P$1 | 86.87,33.22 J79.P$1 | 89.31,33.22 J79.P$2
  Top 0.61: 89.31,33.22 86.87,33.22
  Bottom 0.203: v94.49,11.48 94.49,17.37 107.19,30.07 107.19,30.89 106.17,31.9 90.63,31.9 | 89.41,33.12 J79.P$2
  Bottom 0.61: 89.41,33.12 90.63,31.9
DRV2_DIR  (via drill 0.51)
  Top 0.203: v61.57,10.67 61.57,10.36 62.99,8.94 63.6,8.94 63.91,9.25 63.91,10.57 U4.P$2 | 65.84,30.68 J83.P$2 | 63.4,30.68 J83.P$1
  Top 0.61: 63.4,30.68 65.84,30.68
  Bottom 0.203: v61.57,10.67 62.69,10.67 63.3,11.28 63.3,30.58 J83.P$1
DRV2_M+
  Top 0.356: U4.P$8 67.84,9.47 68.26,9.37
  Top 1.016: 68.26,9.37 77.47,9.37 77.47,11.27 SV8.1 SV8.3 SV8.5
DRV2_M-
  Top 0.356: U4.P$10 67.19,19.09 67.63,19.53
  Top 1.016: 67.63,19.53 71.75,19.53 SV8.6 SV8.4 SV8.2
DRV2_PWM  (via drill 0.51)
  Top 0.203: v62.38,11.48 63.2,10.67 U4.P$1 | 65.84,33.22 J82.P$2 | 63.4,33.22 J82.P$1
  Top 0.61: 63.4,33.22 65.84,33.22
  Bottom 0.203: v62.38,11.48 62.38,30.07 62.18,30.28 62.18,32 | 63.3,33.12 J82.P$1
  Bottom 0.61: 63.3,33.12 62.18,32
GND  (via drill 0.51)
  Top 0.356: U2.P$16 95.36,13.97 U2.P$17 | U2.P$15 96.01,13.97 U2.P$17 | U2.P$9 99.91,13.97 U2.P$17 | U2.P$7 99.26,13.97 U2.P$17 | U4.P$16 63.29,14.18 63.5,13.97 | U4.P$15 63.94,14.17 64.14,13.97 | U4.P$9 67.84,14.08 67.94,13.97 | U4.P$7 67.19,13.93 67.15,13.97
  Top 0.61: ETH1.P$12 137.16,116.74 141.43,112.47 141.43,104.34 S28.P$10 141.63,104.14 141.63,101.8 S28.P$9 141.63,101.6 141.63,99.26 S28.P$8 141.63,99.06 141.63,96.72 S28.P$7 141.63,96.52 141.63,94.18 S28.P$6 141.63,93.98 141.63,91.64 S28.P$5 141.63,91.44 141.63,89.1 S28.P$4 141.63,88.9 141.63,86.56 S28.P$3 141.63,86.36 141.63,84.02 S28.P$2 141.63,83.82 141.63,81.48 S28.P$1 141.63,81.28 141.63,78.94 S24.P$10 141.63,78.74 141.63,76.4 S24.P$9 141.63,76.2 141.63,73.86 S24.P$8 141.63,73.66 141.63,71.32 S24.P$7 141.63,71.12 141.63,68.78 S24.P$6 141.63,68.58 141.63,66.24 S24.P$5 141.63,66.04 141.63,63.7 S24.P$4 141.63,63.5 141.63,61.16 S24.P$3 141.63,60.96 141.63,58.62 S24.P$2 141.63,58.42 141.63,56.08 S24.P$1 141.63,55.88 141.63,53.54 S20.P$10 141.63,53.34 141.63,51 S20.P$9 141.63,50.8 141.63,48.46 S20.P$8 141.63,48.26 141.63,45.92 S20.P$7 141.63,45.72 141.63,43.38 S20.P$6 141.63,43.18 141.63,40.84 S20.P$5 141.63,40.64 141.63,38.3 S20.P$4 141.63,38.1 141.63,35.76 S20.P$3 141.63,35.56 141.63,33.22 S20.P$2 141.63,33.02 141.63,30.48 S20.P$1 141.33,30.38 139.5,30.38 138.28,29.16 102.92,29.16 | L1.P$20 92.76,165.81 95.2,165.81 J102.P$1 95.5,165.81 97.74,165.81 J102.P$2 98.04,165.81 100.28,165.81 J102.P$3 | C9.2 92.15,177.29 106.17,177.29 J7.P$2 108.81,174.35 108.81,172.11 J7.P$1 | v82.6,182.47 82.6,180.24 IC2.7 | v82.6,189.28 82.6,192.94 IC1.7 | v114,188.67 100.08,188.67 98.75,189.99 92.15,189.99 C6.2 91.85,189.89 91.44,189.48 v90.32,189.48 | J76.P$2 138.58,180.24 141.02,180.24 J76.P$1 | J74.P$2 138.58,185.32 141.02,185.32 J74.P$1
  Top 0.61: J76.P$1 141.02,180.54 141.02,185.01 J74.P$1 | J72.P$1 141.02,190.4 138.58,190.4 J72.P$2 138.28,190.5 137.06,191.72 127.91,191.72 126.9,190.7 116.33,190.7 B1.P$2 | J70.P$2 138.58,195.48 141.02,195.48 J70.P$1 141.02,195.17 141.02,190.7 J72.P$1 | J74.P$1 141.02,185.62 141.02,190.09 J72.P$1 | SV6.3 118.77,133.91 121.21,133.91 SV6.4 | ETH1.P$1 ETH1.P$2 | v130.76,140.51 133.3,140.51 ETH1.P$2 | J76.P$1 141.22,179.93 141.22,171.5 143.15,169.57 143.15,160.12 141.94,158.9 SV11.1 | v131.67,124.36 131.67,136.25 ETH1.P$2 | J124.P$1 81.28,62.48 83.82,62.48 J124.P$2 84.02,62.48 86.36,62.48 J124.P$3 86.56,62.48 88.9,62.48 U$1.2 88.9,62.08 88.9,61.77 102.92,47.75 102.92,29.16 | SV12.1 101.7,104.75 101.7,103.73 100.48,102.51 J153.P$3 100.28,102.31 98.04,102.31 J153.P$2 97.74,102.31 95.5,102.31 J153.P$1 95.2,102.31 92.76,102.31 L1.P$60 92.46,102.31 91.95,102.31 90.53,103.73 84.12,103.73 64.21,123.65 B2.P$2 | C10.2 91.44,128.73 92.86,127.31 92.86,125.17 91.95,124.26 81.38,124.26 81.08,124.56 | 81.08,124.56 81.08,128.63 81.89,129.44 81.89,131.98 IC3.7 | L1.P$62 49.58,99.77 52.02,99.77 J151.P$1 52.32,99.77 54.56,99.77 J151.P$2 54.86,99.77 57.1,99.77 J151.P$3 | v80.87,124.56 81.08,124.56 | S129.P$5 S129.P$4 S129.P$3 S129.P$2 S129.P$1 | S137.P$5 S137.P$4 S137.P$3 6.5,147.12 7.21,146.41 | 7.21,146.41 7.21,137.47 DCDC5V.2 | 7.21,146.41 8.13,147.32 S137.P$2 S137.P$1 | C4.2 52.53,194.36 50.09,194.36 47.45,191.72 47.45,188.06 48.16,187.35 48.97,187.35 U7.4 49.07,187.05 50.8,185.32 v50.8,177.5 50.6,177.29 29.16,177.29 28.65,176.78 G1.- 28.35,176.68 25.91,179.12 23.88,179.12
  Top 0.61: 23.88,194.77 19,194.77 18.59,194.36 T2.3 18.49,194.67 16.66,196.49 12.9,196.49 10.77,194.36 7.32,194.36 T1.3 | 23.88,194.77 28.75,194.77 SV13.2 | 23.88,179.12 13.41,179.12 12.39,178.1 12.39,177.19 U3.4 | 23.88,179.12 23.88,194.77 | SV4.26 8.33,81.99 10.77,81.99 SV4.25 11.07,81.99 12.09,81.99 | 12.09,81.99 21.64,81.99 26.21,86.56 B3.P$1 | SV2.30 3.25,87.07 5.69,87.07 SV2.29 | SV2.34 3.25,92.15 5.69,92.15 SV2.33 | SV2.30 3.05,87.27 3.05,87.78 1.83,89 1.83,90.63 3.05,91.85 SV2.34 | SV2.20 3.25,74.37 5.69,74.37 SV2.19 | SV2.5 5.69,56.59 3.25,56.59 SV2.6 3.05,56.79 3.05,57.3 1.83,58.52 1.83,65.23 3.05,66.45 SV2.14 | SV2.14 3.25,66.75 5.69,66.75 SV2.13 | SV2.20 3.05,74.07 3.05,73.46 1.83,72.24 1.83,68.17 3.05,66.95 SV2.14 | SV2.30 2.95,86.77 2.95,86.06 1.83,84.94 1.83,75.79 3.05,74.57 SV2.20 | 5.69,104.04 4.37,105.36 POWER.1 | 5.69,104.04 8.13,101.6 8.13,99.97 SV4.40 8.33,99.77 10.77,99.77 SV4.39 10.97,99.47 12.09,98.35 12.09,81.99 | C3.2 28.85,116.53 28.85,111.05 27.43,109.63 26.62,109.63 U6.P$4 26.31,109.63 23.16,109.63 14.94,117.86 5V.C | 5V.C 13.31,120.5 3V3.C 13.11,120.7 v13.11,122.02 | 5V.C 13.01,117.75 11.99,117.75 6.2,111.96 5.99,111.96 J5.3 6.4,111.76 8.94,109.22 8.94,107.49 J5.2 | 5.69,104.04 1.83,100.18 1.83,94.08 3.05,92.86 3.05,92.35 SV2.34 | TRIMPOT1.6 TRIMPOT1.5 89,2.74 89,3.45 87.88,4.57 87.88,14.05 | C22.2 71.02,21.54 78.23,21.54 84.84,14.94 v86.36,13.97 84.94,12.9 75.59,3.56 R43.2 | v103.63,20.02 103.02,20.62 103.02,21.54 C16.2 102.92,21.84 102.92,29.16 | v102.72,8.43 107.59,3.56 R41.2 | TRIMPOT2.5 45.31,10.67 47.75,10.67 TRIMPOT2.6 48.06,10.67 52.73,10.67
  Top 0.61: S1.P$1 46.13,22.86 46.13,21.54 52.32,15.34 53.34,13.89 | 52.73,10.67 52.73,12.19 v53.34,13.81 | 52.73,10.67 52.73,4.37 S159.P$1 | C25.- 56.9,14.12 C28.- | U5.5 43.69,57.3 44.91,57.3 U5.4 | U5.5 43.79,57.61 43.79,60.15 C2.2 43.59,60.35 43.59,62.79 R7.1 43.28,62.99 32.92,62.99 31.5,64.41 29.16,64.41 27.84,63.09 R3.1 27.64,62.79 27.64,60.35 C14.2 27.74,60.05 27.74,57.3 | U5.11 42.47,48.16 43.59,48.16 U5.12 43.89,48.16 44.91,48.16 U5.13 | 39.32,52.02 38,52.02 JP3.2 | 39.32,52.02 42.47,48.87 42.47,48.46 U5.11 | C1.- 42.27,39.42 42.27,43.79 42.16,43.89 42.16,47.95 U5.11 | 39.32,52.02 43.59,56.29 43.59,57 U5.5 | 27.74,57.3 28.35,57.3 U1.4 | 27.74,57.3 27.23,57.3 U1.5 27.03,57 27.03,55.17 23.37,51.51 | SV4.10 8.33,61.67 10.77,61.67 SV4.9 10.97,61.87 12.09,62.99 12.09,81.99 | U1.13 28.35,48.16 27.43,48.16 U1.12 27.13,48.16 25.91,48.16 U1.11 25.91,48.46 25.91,48.97 23.98,50.9 | 23.98,50.9 23.37,51.51 | 23.37,51.51 22.86,52.02 21.44,52.02 JP2.2 | 23.98,50.9 22.45,49.38 22.45,45.31 25.7,42.06 25.7,39.42 C13.-
  Top 3.302: C20.- 99.82,14.05 99.91,13.97
  Top 3.556: v86.36,13.97 86.44,14.05 87.88,14.05 C20.- | v53.34,13.81 53.34,13.89 C28.- 56.83,13.97 63.5,13.97 64.14,13.97 U4.P$17 67.15,13.97 67.94,13.97
  Bottom 0.61: J7.P$1 110.13,170.79 110.13,166.42 109.42,165.71 100.38,165.71 J102.P$3 | v82.6,182.47 v82.6,189.28 82.8,189.48 v90.32,189.48 | B1.P$2 116.33,190.6 114.4,188.67 v114,188.67 108.92,183.59 108.92,174.65 J7.P$2 | ETH1.P$1 137.16,149.86 141.83,154.53 141.83,158.8 SV11.1 | v130.76,140.51 123.95,140.51 123.14,139.7 123.14,136.45 121.31,134.62 121.31,133.91 SV6.4 | v131.67,124.36 ETH1.P$12 | U$1.2 89,62.48 89,63.2 99.06,73.25 99.06,100.99 97.84,102.21 J153.P$2 | J151.P$3 57.2,99.77 57.2,100.48 64.11,107.39 64.11,123.65 B2.P$2 64.41,123.85 65.13,124.56 v80.87,124.56 | DCDC3.3V.2 27.03,137.47 26.72,137.47 22.66,141.53 17.27,141.53 11.48,147.32 S137.P$1 11.68,147.52 12.7,148.54 12.7,153.01 11.48,154.23 11.48,157.48 S129.P$1 11.68,157.68 11.68,158.39 12.7,159.41 12.7,165.71 23.57,176.58 28.35,176.58 G1.- | 50.8,163.27 52.02,163.27 J104.P$1 52.32,163.27 54.56,163.27 J104.P$2 54.86,163.27 57.1,163.27 J104.P$3 | 50.8,163.27 49.58,163.27 L1.P$22 | v50.8,177.5 50.8,163.27 | POWER.1 4.37,105.46 7.01,105.46 8.94,107.39 J5.2 | v103.63,20.02 97.64,14.02 U2.P$17 97.74,13.72 102.72,8.74 v102.72,8.43 | JP3.2 38,52.02 42.27,47.75 42.27,39.62 C15.- 42.37,39.22 47.24,34.34 47.24,28.85 46.13,27.74 46.13,22.86 S1.P$1 | C12.- 25.7,39.62 25.7,42.06 21.44,46.33 21.44,52.02 JP2.2 21.23,52.32 11.99,61.57 10.87,61.57 SV4.9 | v86.36,13.97 84.84,14.94 78.23,14.94 77.93,15.24 66.85,15.24 65.63,14.02 U4.P$17 | v13.11,122.02 13.11,127.91 7.32,133.71 7.32,137.36 DCDC5V.2
  Bottom 3.556: C27.- 88.83,13.97 v86.36,13.97 | v53.34,13.81 56.83,13.81 C28.-
  pour Top: 33.91,0 33.91,27.05 0,27.05 0,198.12 144.78,198.12 144.78,27.05 110.87,27.05 110.87,0
  pour Bottom: 33.91,0 33.91,27.05 0,27.05 0,198.12 144.78,198.12 144.78,27.05 110.87,27.05 110.87,0
GPIO0
  Top 0.203: 123.85,128.83 J11.P$1 | 126.29,128.83 J11.P$2 | 87.68,165.81 J122.P$3 | 85.14,165.81 J122.P$2
  Top 0.61: 126.29,128.83 123.85,128.83 | J122.P$1 82.6,165.81 85.04,165.81 J122.P$2 | 87.68,165.81 90.12,165.81 L1.P$40 | 85.14,165.81 87.58,165.81 J122.P$3
  Bottom 0.203: J11.P$1 123.85,128.83 123.85,131.67 130.96,138.79 130.96,139.6 131.57,140.21 131.57,147.01 125.48,153.11 111.96,153.11 100.48,164.59 91.34,164.59 90.22,165.71 L1.P$40
GPIO1
  Top 0.203: 87.68,163.27 J121.P$3 | 85.14,163.27 J121.P$2
  Top 0.61: 87.68,163.27 90.12,163.27 L1.P$39 | J121.P$1 82.6,163.27 85.04,163.27 J121.P$2 | 85.14,163.27 87.58,163.27 J121.P$3
  Bottom 0.203: 34.95,192.23 48.87,178.31 63.3,178.31 71.93,169.67 71.93,165.91 74.57,163.27 82.5,163.27 | 33.93,192.23 SV13.5
  Bottom 0.61: 34.95,192.23 33.93,192.23 | 82.5,163.27 J121.P$1
GPIO2  (via drill 0.51)
  Top 0.203: 87.68,160.73 J120.P$3 | 11.68,41.76 J198.P$1 11.68,41.86 | J198.P$2 | 85.04,160.73 J120.P$2 | 11.68,42.67 10.46,43.89 10.46,47.85 v25.7,63.09 | v45.72,93.78 45.72,94.89 46.84,96.01 47.45,96.01 48.26,96.83 v48.26,98.86 | v77.22,140.11 77.22,156.57 v79.15,158.5
  Top 0.61: 87.68,160.73 90.12,160.73 L1.P$38 | J198.P$2 11.68,41.76 | 85.04,160.73 82.6,160.73 J120.P$1 | 11.68,42.67 11.68,41.86 | J120.P$3 87.58,160.73 85.14,160.73 J120.P$2
  Bottom 0.203: v25.7,63.09 25.7,64.11 40.84,79.25 40.84,87.48 41.76,88.39 42.37,88.39 43.38,89.41 43.38,90.02 44.3,90.93 44.91,90.93 45.72,91.75 v45.72,93.78 | v48.26,98.86 48.26,100.38 48.46,100.58 48.46,103.12 62.28,116.94 62.28,125.17 v77.22,140.11 | 80.37,158.5 v79.15,158.5 | 82.5,160.63 J120.P$1
  Bottom 0.61: 82.5,160.63 80.37,158.5
GPIO3  (via drill 0.51)
  Top 0.203: 87.68,158.19 J119.P$3 | 11.68,44.3 J199.P$1 | J199.P$2 14.22,44.3 | 14.22,50.49 26.52,62.79 26.52,64.01 29.46,66.95 v43.99,66.95 | v80.06,128.02 80.06,128.52 81.28,129.74 81.28,156.87 82.5,158.09 J119.P$1 | 85.14,158.19 J119.P$2
  Top 0.61: 87.68,158.19 90.12,158.19 L1.P$37 | J199.P$2 11.68,44.3 | J119.P$1 82.6,158.19 85.04,158.19 J119.P$2 | 14.22,50.49 14.22,44.3 | 85.14,158.19 87.58,158.19 J119.P$3
  Bottom 0.203: v43.99,66.95 43.99,67.16 56.08,79.25 56.08,95.1 57,96.01 57.61,96.01 81.69,120.09 81.69,126.39 v80.06,128.02
GPIO4  (via drill 0.51)
  Top 0.203: 128.42,195.48 J71.P$2 128.32,195.38 v110.44,195.38 | 130.86,195.48 J71.P$1 | 85.04,155.65 J118.P$2 | 87.58,155.65 J118.P$3
  Top 0.61: 130.86,195.48 128.42,195.48 | 85.04,155.65 82.6,155.65 J118.P$1 | J118.P$3 87.68,155.65 90.12,155.65 L1.P$36 | 87.58,155.65 85.14,155.65 J118.P$2
  Bottom 0.203: v110.44,195.38 109.93,195.38 86.56,172.01 86.56,156.67 87.58,155.65 J118.P$3
GPIO5
  Top 0.203: 128.42,190.4 J73.P$2 | 130.86,190.4 J73.P$1 | 85.14,153.11 J117.P$2 | 87.58,153.11 J117.P$3
  Top 0.61: 130.86,190.4 128.42,190.4 | J117.P$1 82.6,153.11 85.04,153.11 J117.P$2 | J117.P$3 87.68,153.11 90.12,153.11 L1.P$35 | 87.58,153.11 85.14,153.11
  Bottom 0.203: 87.58,153.11 86.56,154.13 86.56,155.65 85.55,156.67 84.94,156.67 84.02,157.58 84.02,163.27 83.01,164.29 74.17,164.29 72.34,166.12 72.34,166.73 72.85,167.23 73.76,167.23 85.85,179.32 90.22,179.32 107.49,196.6 115.01,196.6 121.21,190.4 128.32,190.4 J73.P$2
  Bottom 0.61: 87.58,153.11 J117.P$3
GPIO6  (via drill 0.51)
  Top 0.203: 128.42,185.32 J75.P$2 | 130.86,185.32 J75.P$1 | 82.6,102.31 J133.P$1 | 87.68,102.31 J133.P$3 | 85.14,102.31 J133.P$2 | v73.15,166.42 73.15,159.51 62.28,148.64 62.28,122.73 82.6,102.41
  Top 0.61: 130.86,185.32 128.42,185.32 | 82.6,102.31 85.04,102.31 J133.P$2 | 87.68,102.31 90.12,102.31 L1.P$80 | 85.14,102.31 87.58,102.31 J133.P$3 | 82.6,102.41 J133.P$1
  Bottom 0.203: 125.68,185.32 114.81,196.19 110.13,196.19 80.37,166.42 v73.15,166.42 | 128.32,185.32 J75.P$2
  Bottom 0.61: 125.68,185.32 128.32,185.32
GPIO7  (via drill 0.51)
  Top 0.203: 128.42,180.24 J77.P$2 | 130.86,180.24 J77.P$1 130.96,180.14 | 85.04,99.77 J134.P$2 | 87.58,99.77 J134.P$3 | 132.28,180.14 139.09,173.33 v139.09,149.76
  Top 0.61: 130.86,180.24 128.42,180.24 | 85.04,99.77 82.6,99.77 J134.P$1 | J134.P$3 87.68,99.77 90.12,99.77 L1.P$79 | 87.58,99.77 85.14,99.77 J134.P$2 | 132.28,180.14 130.96,180.14
  Bottom 0.203: v139.09,149.76 139.09,119.28 135.23,115.42 108.81,115.42 101.8,108.41 99.87,108.41 93.78,102.31 93.78,101.7 92.86,100.79 91.24,100.79
  Bottom 0.61: 91.24,100.79 90.22,99.77 L1.P$79
GPIO8  (via drill 0.51)
  Top 0.203: 85.04,97.23 J135.P$2 | 141.83,168.05 140.72,166.93 140.72,151.38 143.15,148.95 143.15,136.96 v133.71,127.51 | 141.83,168.96 SV11.5 | 87.58,97.23 J135.P$3
  Top 0.61: J135.P$3 87.68,97.23 90.12,97.23 L1.P$78 | 85.04,97.23 82.6,97.23 J135.P$1 | 141.83,168.05 141.83,168.96 | 87.58,97.23 85.14,97.23 J135.P$2
  Bottom 0.203: v133.71,127.51 128.93,122.73 128.93,121.82 127.1,119.99 110.85,119.99 101.8,110.95 89.81,110.95 83.92,105.05 83.92,98.35
  Bottom 0.61: 83.92,98.35 85.04,97.23 J135.P$2
GPIO9
  Top 0.203: 85.04,94.69 J136.P$2 | 87.68,94.69 J136.P$3
  Top 0.61: 85.04,94.69 82.6,94.69 J136.P$1 | 87.68,94.69 90.12,94.69 L1.P$77 | J136.P$2 85.14,94.69 87.58,94.69 J136.P$3
GPIO10
  Top 0.203: 87.68,92.15 J137.P$3 | 81.79,33.22 J84.P$1 | 84.23,33.22 J84.P$2 | 85.14,92.15 J137.P$2
  Top 0.61: 87.68,92.15 90.12,92.15 L1.P$76 | 84.23,33.22 81.79,33.22 | J137.P$1 82.6,92.15 85.04,92.15 J137.P$2 | 85.14,92.15 87.58,92.15 J137.P$3
  Bottom 0.203: 81.69,40.13 77.62,44.2 77.62,72.85 83.62,78.84 83.62,91.03 | 81.69,33.22 J84.P$1
  Bottom 0.61: 81.69,40.13 81.69,33.22 | 83.62,91.03 82.6,92.05 J137.P$1
GPIO11
  Top 0.203: 87.68,89.61 J138.P$3 | 58.32,33.22 J86.P$1 | 60.76,33.22 J86.P$2 | 85.04,89.61 J138.P$2
  Top 0.61: 87.68,89.61 90.12,89.61 L1.P$75 | 60.76,33.22 58.32,33.22 | 85.04,89.61 82.6,89.61 J138.P$1 | J138.P$3 87.58,89.61 85.14,89.61 J138.P$2
  Bottom 0.203: 60.86,67.87 82.5,89.51 J138.P$1 | 60.86,33.22 J86.P$2
  Bottom 0.61: 60.86,67.87 60.86,33.22
GPIO14
  Top 0.203: 82.6,87.07 J139.P$1 | 85.04,87.07 J139.P$2 | 20.73,162.56 38.3,144.98 38.3,141.22 81.48,98.04 81.48,88.29
  Top 0.61: J201.P$1 J201.P$2 20.73,162.56 | 85.04,87.07 82.6,87.07 | L1.P$74 90.12,87.07 87.68,87.07 J139.P$3 87.58,87.07 85.14,87.07 J139.P$2 | 81.48,88.29 82.6,87.17 J139.P$1
GPIO15  (via drill 0.51)
  Top 0.203: 87.68,84.53 J140.P$3 | 85.14,84.53 J140.P$2 | 16.56,151.38 17.58,150.37 17.58,143.56 17.27,143.26 17.27,142.44 31.19,128.52 34.65,128.52 v78.64,84.53 | 16.56,152.4 J202.P$2
  Top 0.61: J202.P$2 J202.P$1 | J140.P$1 82.6,84.53 85.04,84.53 J140.P$2 | 87.68,84.53 90.12,84.53 L1.P$73 | 85.14,84.53 87.58,84.53 J140.P$3 | 16.56,151.38 16.56,152.4
  Bottom 0.61: v78.64,84.53 82.5,84.53 J140.P$1
GPIO16
  Top 0.203: 106.27,167.03 J251.P$1 106.27,166.93 105.66,166.93 100.48,161.75 92.25,161.75 91.24,160.73 91.24,149.05 90.22,148.03 L1.P$33 | 106.27,169.47 J251.P$2 | 85.04,148.03 J115.P$2 | 87.58,148.03 J115.P$3
  Top 0.61: 106.27,169.47 106.27,167.03 | 85.04,148.03 82.6,148.03 J115.P$1 | 87.58,148.03 85.14,148.03 J115.P$2
  Bottom 0.203: J115.P$3 87.68,148.03 90.12,148.03 L1.P$33
GPIO18
  Top 0.203: 41.86,158.19 J16.P$2 | 48.06,159.21 48.06,160.73 49.07,161.75 49.68,161.75 50.6,162.66 50.6,163.27 51.61,164.29 52.22,164.29 53.14,165.2 53.14,187.15 54.56,188.57 55.07,188.57 U7.6 | 46.94,158.19 L1.P$4 | 44.4,158.19 J16.P$3
  Top 0.61: 41.86,158.19 39.42,158.19 J16.P$1 | 48.06,159.21 47.04,158.19 L1.P$4 | 46.94,158.19 44.5,158.19 J16.P$3 | 44.4,158.19 41.96,158.19 J16.P$2
GPIO19
  Top 0.203: U7.1 49.07,191.11 49.58,191.11 51.82,188.87 51.82,169.98 48.06,166.22 48.06,161.75 47.04,160.73 L1.P$3 | 41.96,160.73 J15.P$2 | 44.4,160.73 J15.P$3
  Top 0.61: J15.P$1 39.42,160.73 41.86,160.73 J15.P$2 | J15.P$3 44.5,160.73 46.94,160.73 L1.P$3 | 44.4,160.73 41.96,160.73
GPIO22  (via drill 0.51)
  Top 0.203: 41.86,148.03 J20.P$2 | v88.29,194.56 89.1,194.56 90.12,193.55 90.12,192.94 IC1.1 | v72.85,168.05 72.85,167.23 59.84,154.23 59.84,151.59 57.3,149.05 48.06,149.05 | 47.04,148.03 L1.P$8 | 44.4,148.03 J20.P$3
  Top 0.61: 41.86,148.03 39.42,148.03 J20.P$1 | 47.04,148.03 48.06,149.05 | J20.P$3 44.5,148.03 46.94,148.03 L1.P$8 | 44.4,148.03 41.96,148.03 J20.P$2
  Bottom 0.203: v88.29,194.56 87.48,194.56 83.01,190.09 82.3,190.09 72.85,180.65 v72.85,168.05
GPIO24
  Top 0.203: 108.61,128.83 J9.P$1 | 111.05,128.83 J9.P$2 | 85.04,150.57 J116.P$2 | 87.58,150.57 J116.P$3
  Top 0.61: 111.05,128.83 108.61,128.83 | 85.04,150.57 82.6,150.57 J116.P$1 | J116.P$3 87.68,150.57 90.12,150.57 L1.P$34 | 87.58,150.57 85.14,150.57 J116.P$2
  Bottom 0.203: 103.94,128.83 91.24,141.53 91.24,149.45 | 108.51,128.83 J9.P$1 | 90.22,150.47 L1.P$34
  Bottom 0.61: 103.94,128.83 108.51,128.83 | 90.22,150.47 91.24,149.45
GPIO25  (via drill 0.51)
  Top 0.203: v87.58,178.51 87.58,180.24 IC2.3 | v79.96,170.89 79.96,129.64 78.84,128.52 78.84,124.87 97.84,105.87 102.62,105.87 102.82,105.66 102.82,81.89 | 100.38,79.45 J162.P$3 100.28,79.45 | 97.84,79.45 J162.P$2 | 95.3,79.45 J162.P$1
  Top 0.61: L1.P$51 92.76,79.45 95.2,79.45 J162.P$1 | 100.38,79.45 102.82,81.89 | 100.28,79.45 97.84,79.45 | 95.3,79.45 97.74,79.45 J162.P$2
  Bottom 0.203: v79.96,170.89 v87.58,178.51
GPIO26  (via drill 0.51)
  Top 0.203: 97.84,84.53 J160.P$2 97.74,84.53 | 100.28,84.53 J160.P$3 | v86.16,178.41 85.14,179.43 85.14,180.24 IC2.5 | v75.59,167.84 75.59,155.85 75.79,155.65 75.79,122.33 73.76,120.29 73.76,117.65 v86.67,104.75 | 95.3,84.53 J160.P$1
  Top 0.61: 100.28,84.53 97.84,84.53 | 95.3,84.53 97.74,84.53
  Bottom 0.203: v75.59,167.84 v86.16,178.41 | v86.67,104.75 89.1,102.31 89.1,99.16 90.02,98.25 90.63,98.25 91.64,97.23 91.64,96.62 92.56,95.71 93.17,95.71 93.78,95.1 93.78,85.55 93.73,85.5 | 92.76,84.53 L1.P$53 | 95.2,84.53 J160.P$1
  Bottom 0.61: 92.76,84.53 93.73,85.5 94.69,84.53 95.2,84.53
GPIO27  (via drill 0.51)
  Top 0.203: IC2.9 83.82,174.65 83.01,175.46 82.09,175.46 76.4,169.77 76.4,123.24 v96.32,103.33
  Top 0.61: L1.P$52 92.76,81.99 95.2,81.99 J161.P$1 | J161.P$3 100.28,81.99 97.84,81.99 J161.P$2
  Bottom 0.203: v96.32,103.33 96.32,99.26 96.72,98.86 96.72,83.01 96.77,82.96
  Bottom 0.61: J161.P$2 97.74,81.99 96.77,82.96 95.81,81.99 95.3,81.99 J161.P$1
GPIO29  (via drill 0.51)
  Top 0.203: 95.2,142.95 J29.P$1 | 81.79,30.68 J85.P$1 | 84.23,30.68 J85.P$2 | 97.84,142.95 J29.P$2 | 100.28,142.95 J29.P$3 100.38,142.85 100.38,131.06 102.82,128.63 v102.82,108.31
  Top 0.61: 95.2,142.95 92.76,142.95 L1.P$11 | 84.23,30.68 81.79,30.68 | 100.28,142.95 97.84,142.95 | J29.P$1 95.3,142.95 97.74,142.95 J29.P$2
  Bottom 0.203: 84.33,31.7 85.75,33.12 85.75,37.39 102.82,54.46 v102.82,108.31 | 84.33,30.68 J85.P$2
  Bottom 0.61: 84.33,31.7 84.33,30.68
GPIO32
  Top 0.203: 58.32,30.68 J87.P$1 | 60.76,30.68 J87.P$2 | 41.86,163.27 J14.P$2 | 44.5,163.27 J14.P$3
  Top 0.61: 60.76,30.68 58.32,30.68 | 41.86,163.27 39.42,163.27 J14.P$1 | 44.5,163.27 46.94,163.27 L1.P$2 | J14.P$2 41.96,163.27 44.4,163.27 J14.P$3
  Bottom 0.203: 58.22,31.7 50.9,39.01 50.9,58.93 43.18,66.65 43.18,73.97 48.06,78.84 48.06,97.64 47.14,98.55 46.53,98.55 45.92,99.16 45.92,108.2 48.06,110.34 48.06,162.15 | 58.22,30.68 J87.P$1 | 47.04,163.17 L1.P$2
  Bottom 0.61: 58.22,31.7 58.22,30.68 | 47.04,163.17 48.06,162.15
GPIO40
  Top 0.203: 39.42,79.45 J163.P$1 | 41.86,79.45 J163.P$2 | 44.4,79.45 J163.P$3 | 9.25,169.88 R9.2 | 3.86,165.81 J208.P$2 3.76,165.81
  Top 0.61: 41.86,79.45 39.42,79.45 | J163.P$3 44.5,79.45 46.94,79.45 L1.P$50 | 44.4,79.45 41.96,79.45 J163.P$2 | 9.25,169.88 7.92,169.88 3.86,165.81 | 3.76,165.81 1.32,165.81 J208.P$1
  Bottom 0.203: 39.32,80.37 31.7,87.99 31.7,88.9 25.6,95 24.08,95 16.87,102.21 16.87,113.08 15.85,114.1 15.24,114.1 7.82,121.51 7.82,132.28 2.74,137.36 2.74,164.69 | 39.32,79.45 J163.P$1
  Bottom 0.61: 39.32,80.37 39.32,79.45 | 2.74,164.69 3.76,165.71 J208.P$2
GPIO41  (via drill 0.51)
  Top 0.203: 18.49,169.98 R10.2 | 17.07,165.81 J209.P$2 | 44.5,81.99 J164.P$3 | 41.96,81.99 J164.P$2
  Top 0.61: v18.49,168.05 18.49,169.98 | 17.07,165.81 14.63,165.81 J209.P$1 | J164.P$1 39.42,81.99 41.86,81.99 J164.P$2 | 44.5,81.99 46.94,81.99 L1.P$49 | 41.96,81.99 44.4,81.99 J164.P$3
  Bottom 0.203: J209.P$2 17.37,165.91 32.51,150.77 32.51,114.91 40.44,106.98 40.44,83.01 39.42,81.99 J164.P$1
  Bottom 0.61: v18.49,168.05 18.49,167.13 17.17,165.81 J209.P$2
GPIO52
  Top 0.203: 41.96,84.53 J165.P$2 | 44.4,84.53 J165.P$3
  Top 0.61: J165.P$1 39.42,84.53 41.86,84.53 J165.P$2 | J165.P$3 44.5,84.53 46.94,84.53 L1.P$48 | 44.4,84.53 41.96,84.53
GPIO56
  Top 0.61: J169.P$1 39.42,94.69 41.86,94.69 J169.P$2
  Bottom 0.203: 35.46,194.77 34.04,193.34 33.43,193.34 32.82,192.74 32.82,176.78 42.98,166.62 42.98,95.71 42.93,95.66 | 36.37,194.77 SV13.8 | 44.4,94.69 J169.P$3 | 44.5,94.69 46.94,94.69 L1.P$44